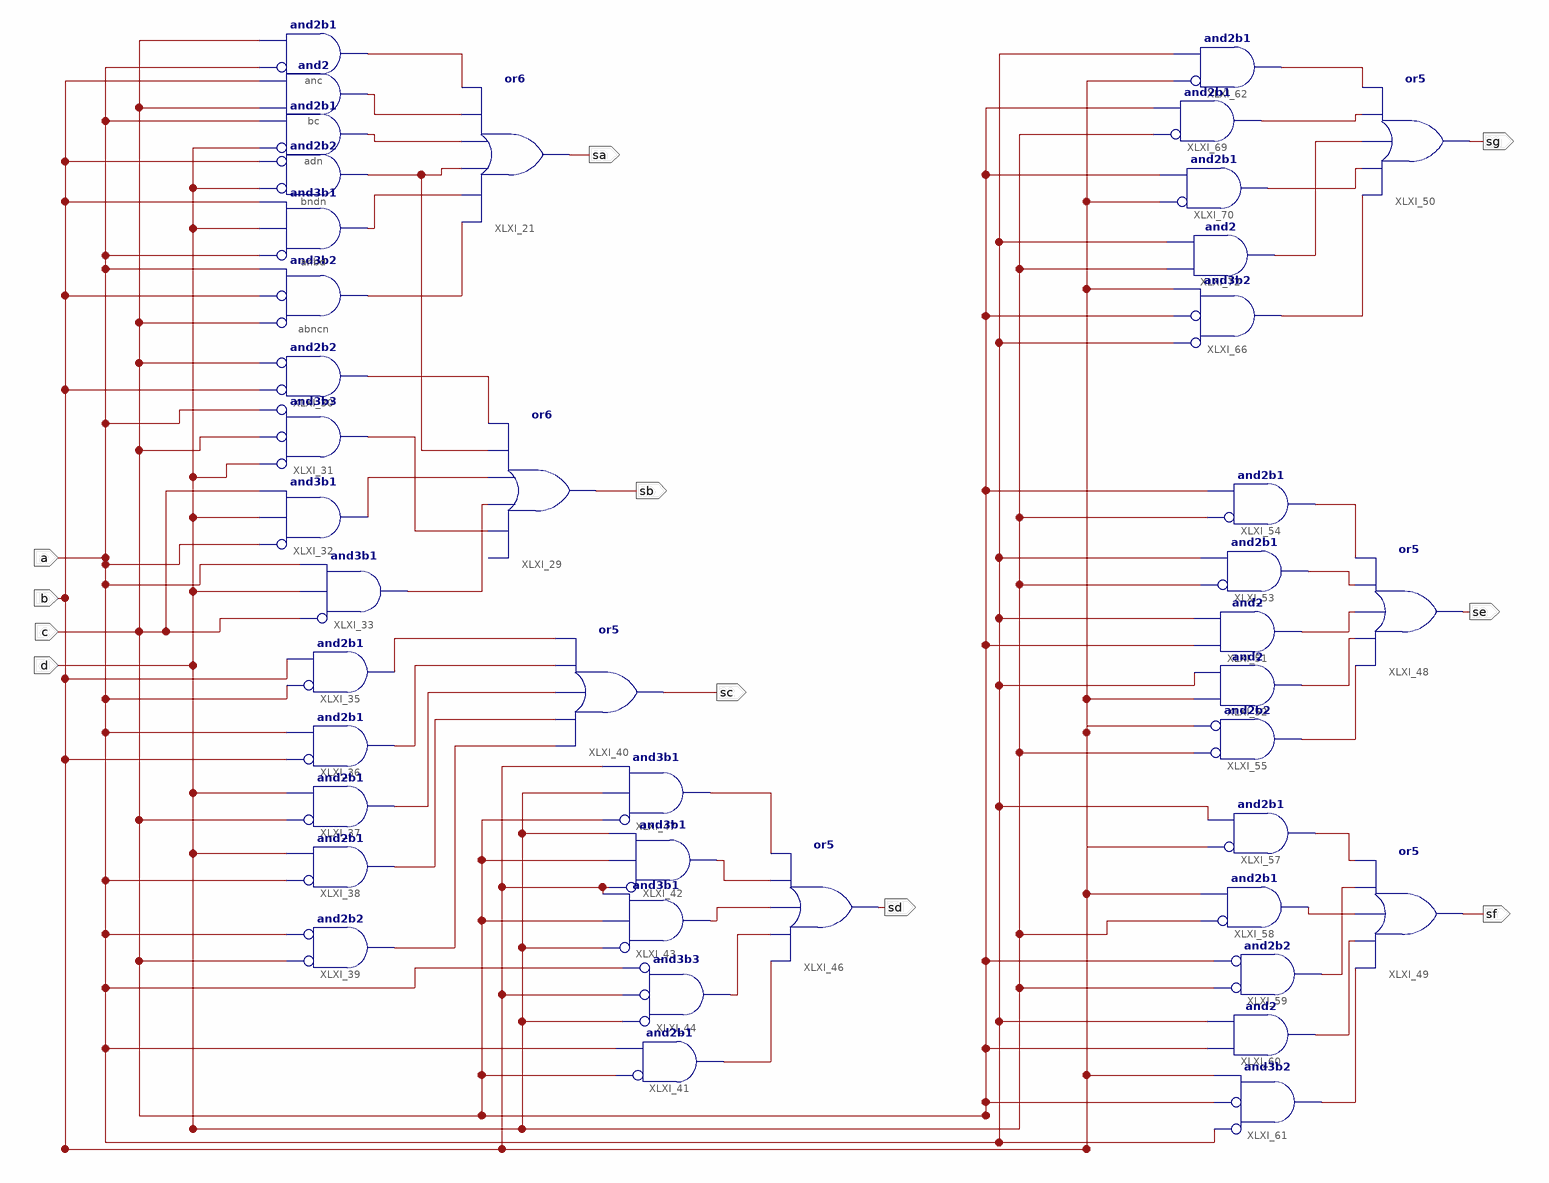
[diagram p0: schematic sheet 1]
// Xilinx ISE schematic reto.sch (spartan3e) as structural Verilog: 42 symbols, 11 ports
module reto (
  input  b,
  input  d,
  input  c,
  input  a,
  output sc,
  output sd,
  output se,
  output sf,
  output sg,
  output sb,
  output sa
);

  wire XLXN_30, XLXN_34, XLXN_63, XLXN_67, XLXN_72, XLXN_75, XLXN_80, XLXN_82, XLXN_102, XLXN_114, XLXN_126,
       XLXN_127, XLXN_128, XLXN_136, XLXN_139, XLXN_140, XLXN_157, XLXN_158, XLXN_159, XLXN_160, XLXN_161,
       XLXN_162, XLXN_165, XLXN_166, XLXN_172, XLXN_173, XLXN_176, XLXN_193, XLXN_194, XLXN_211, XLXN_244,
       XLXN_247, XLXN_257, XLXN_310, XLXN_319;

  or XLXI_29 (sb, XLXN_319, XLXN_75, XLXN_102, XLXN_82, XLXN_72);  // open: I0
  and XLXI_31 (XLXN_319, ~d, ~c, ~a);  // and3b3
  and XLXI_33 (XLXN_75, ~c, d, a);  // and3b1
  and XLXI_35 (XLXN_114, ~a, b);  // and2b1
  and XLXI_36 (XLXN_127, ~b, a);  // and2b1
  and XLXI_37 (XLXN_128, ~c, d);  // and2b1
  and XLXI_38 (XLXN_310, ~a, d);  // and2b1
  and XLXI_39 (XLXN_126, ~c, ~a);  // and2b2
  or XLXI_40 (sc, XLXN_126, XLXN_310, XLXN_128, XLXN_127, XLXN_114);
  and XLXI_41 (XLXN_140, ~c, a);  // and2b1
  and XLXI_42 (XLXN_193, ~b, c, d);  // and3b1
  and XLXI_43 (XLXN_194, ~d, c, b);  // and3b1
  and XLXI_44 (XLXN_139, ~d, ~b, ~a);  // and3b3
  or XLXI_46 (sd, XLXN_140, XLXN_139, XLXN_194, XLXN_193, XLXN_136);
  and XLXI_47 (XLXN_136, ~c, d, b);  // and3b1
  or XLXI_48 (se, XLXN_161, XLXN_160, XLXN_159, XLXN_158, XLXN_157);
  or XLXI_49 (sf, XLXN_166, XLXN_165, XLXN_257, XLXN_211, XLXN_162);
  or XLXI_50 (sg, XLXN_176, XLXN_247, XLXN_244, XLXN_173, XLXN_172);
  and XLXI_51 (XLXN_159, c, a);
  and XLXI_52 (XLXN_160, b, a);
  and XLXI_53 (XLXN_158, ~d, a);  // and2b1
  and XLXI_54 (XLXN_157, ~d, c);  // and2b1
  and XLXI_55 (XLXN_161, ~d, ~b);  // and2b2
  and XLXI_57 (XLXN_162, ~b, a);  // and2b1
  and XLXI_58 (XLXN_257, ~d, b);  // and2b1
  and XLXI_59 (XLXN_211, ~d, ~c);  // and2b2
  and XLXI_60 (XLXN_165, c, a);
  and XLXI_62 (XLXN_172, ~b, a);  // and2b1
  and XLXI_66 (XLXN_176, ~a, ~c, b);  // and3b2
  and XLXI_69 (XLXN_173, ~d, c);  // and2b1
  and XLXI_70 (XLXN_247, ~b, c);  // and2b1
  and XLXI_72 (XLXN_244, d, a);
  and XLXI_30 (XLXN_72, ~b, ~c);  // and2b2
  and XLXI_61 (XLXN_166, ~a, ~c, b);  // and3b2
  or XLXI_21 (sa, XLXN_63, XLXN_67, XLXN_82, XLXN_80, XLXN_34, XLXN_30);
  and abncn (XLXN_63, ~c, ~b, a);  // and3b2
  and anbd (XLXN_67, ~a, d, b);  // and3b1
  and bndn (XLXN_82, ~d, ~b);  // and2b2
  and adn (XLXN_80, ~d, a);  // and2b1
  and bc (XLXN_34, c, b);
  and anc (XLXN_30, ~a, c);  // and2b1
  and XLXI_32 (XLXN_102, ~a, d, c);  // and3b1
endmodule
